# Altium schematic sheet HLib-I2CDevices.SchDoc: HLib - I2C devices
size A; DrawnBy: Nhat Pham; DocumentNumber: 1; Revision: 0.1; SheetNumber: 1; ProjectName: HLib
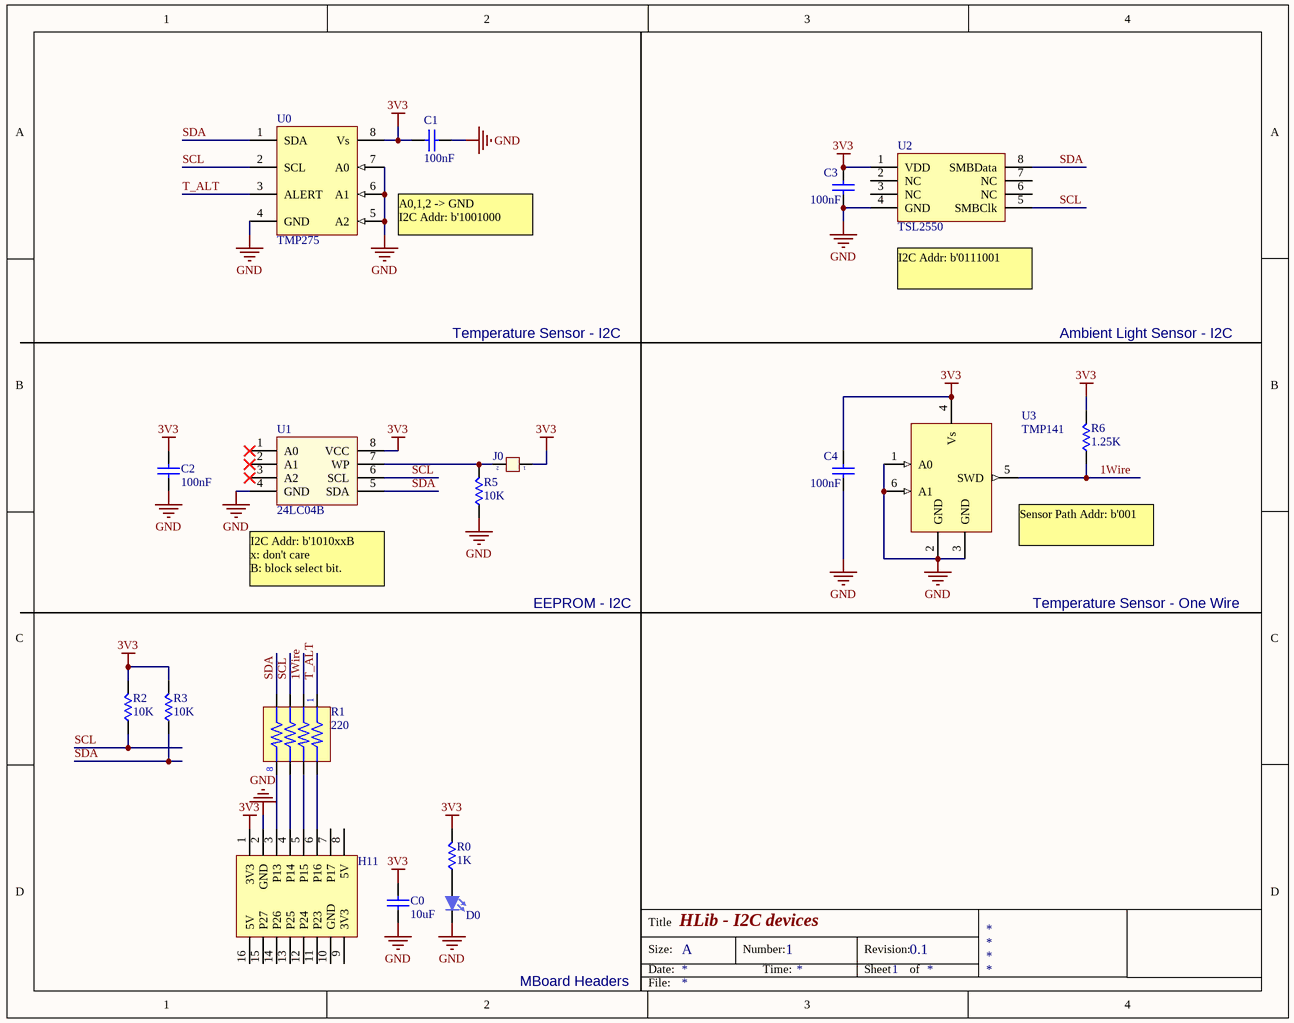
[diagram p0: HLib-I2CDevices.SchDoc]

## Parts
C0  value 10uF  [SM_0805_C_CERAMIC]  (hidden comment: C_Ceramic)
C1  value 100nF  [SM_0805_C_CERAMIC]  (hidden comment: C_Ceramic)
C2  value 100nF  [SM_0805_C_CERAMIC]  (hidden comment: C_Ceramic)
C3  value 100nF  [SM_0805_C_CERAMIC]  (hidden comment: C_Ceramic)
C4  value 100nF  [SM_0805_C_CERAMIC]  (hidden comment: C_Ceramic)
D0  LED  [SM_0805_LED]  (value not drawn)
H11  MBoard1_BH_DualPorts  [MBoard1_BH_DualPorts]  (value not drawn)
J0  Jumper 2  [HD_MALE_2_100mil_straight]  (value not drawn)
R0  value 1K  [SM_0805_R]  (hidden comment: R)
R1  220  [RA4]
R2  value 10K  [SM_0805_R]  (hidden comment: R)
R3  value 10K  [SM_0805_R]  (hidden comment: R)
R5  value 10K  [SM_0805_R]  (hidden comment: R)
R6  value 1.25K  [SM_0805_R]  (hidden comment: R)
U0  TMP275  [SO-8]
U1  24LC04B  [SO-8]
U2  TSL2550  [SO-8]
U3  TMP141  [SOT23-6]

## Nets
3V3: C0.2 C1.2 C2.1 C3.1 C4.1 H11.1(3V3) J0.1 R0.2 R2.2 R3.2 R6.2 U0.8(Vs) U1.8(VCC) U2.1(VDD) U3.4(Vs)
GND: C0.1 C1.1 C2.2 C3.2 C4.2 D0.2(K) H11.2(GND) R5.1 U0.4(GND) U0.5(A2) U0.6(A1) U0.7(A0) U1.4(GND) U2.4(GND) U3.1(A0) U3.2(GND) U3.3(GND) U3.6(A1)
1Wire: R1.3 R6.1 U3.5(SWD)
SCL: R1.5 R2.1 U0.2(SCL) U1.6(SCL) U2.5(SMBClk)
SDA: R1.7 R3.1 U0.1(SDA) U1.5(SDA) U2.8(SMBData)
T_ALT: R1.1 U0.3(ALERT)
NetD0_1: D0.1(A) R0.1
NetH11_3: H11.3(P13) R1.8
NetH11_4: H11.4(P14) R1.6
NetH11_5: H11.5(P15) R1.4
NetH11_6: H11.6(P16) R1.2
NetJ0_2: J0.2 R5.2 U1.7(WP)

Not connected (* = marked no-connect by the designer): H11 7(P17) 8(5V) 9(3V3) 10(GND) 11(P23) 12(P24) 13(P25) 14(P26) 15(P27) 16(5V); U1 1(A0)* 2(A1)* 3(A2)*; U2 2(NC) 3(NC) 6(NC) 7(NC)

## Notes on the sheet
- A0,1,2 -> GND
  I2C Addr: b'1001000
- (near U2) I2C Addr: b'0111001
- Temperature Sensor - I2C
- Ambient Light Sensor - I2C
- (near U3) Sensor Path Addr: b'001
- (near U1) I2C Addr: b'1010xxB
  x: don't care
  B: block select bit.
- EEPROM - I2C
- Temperature Sensor - One Wire
- MBoard Headers
- Title
- Size:
- Date:
- A
- Number:
- Time:
- Revision:
- Sheet
- of
- File:

## Library data of the parts
C0-C4 = C_Ceramic: Non-polarity ceramic capacitor; Published: 8-Jun-2000; LatestRevisionDate: 17-Jul-2002; LatestRevisionNote: Re-released for DXP Platform.; PackageReference: RAD-0.3; Publisher: Altium Limited; PackageDescription: Radial Cap, Thru-Hole; 2 Leads; 0.3 in Pin Spacing
J0 = JP 2: Value: JP 2
R0 R2 R3 R5 R6 = R: Resistor; Published: 8-Jun-2000; LatestRevisionDate: 29-May-2009; LatestRevisionNote: IPC-7351 Footprint Added.; PackageReference: J1-0603; Publisher: Altium Limited; PackageDescription: Chip Resistor
R1 = RA4
U0 = TMP75C
U1 = 24Cxx: Standard 2-Wire Bus Interface Serial EEPROM; Value: 24Cxx; Value: DIP 8; Copyright by: VanDungEvn
D0 = LED: Published: 8-Jun-2000; LatestRevisionDate: 08-Jul-2005; LatestRevisionNote: Mech Layer 1 removed.; PackageReference: LED-1; Publisher: Altium Limited; PackageDescription: LED; 2 Leads